# Altium schematic sheet CPU.SchDoc
size A4; Address1: PXL EAI 1001; Revision: V 1.0; SheetNumber: 2; SheetTotal: 5; Sheet: 2 van 5
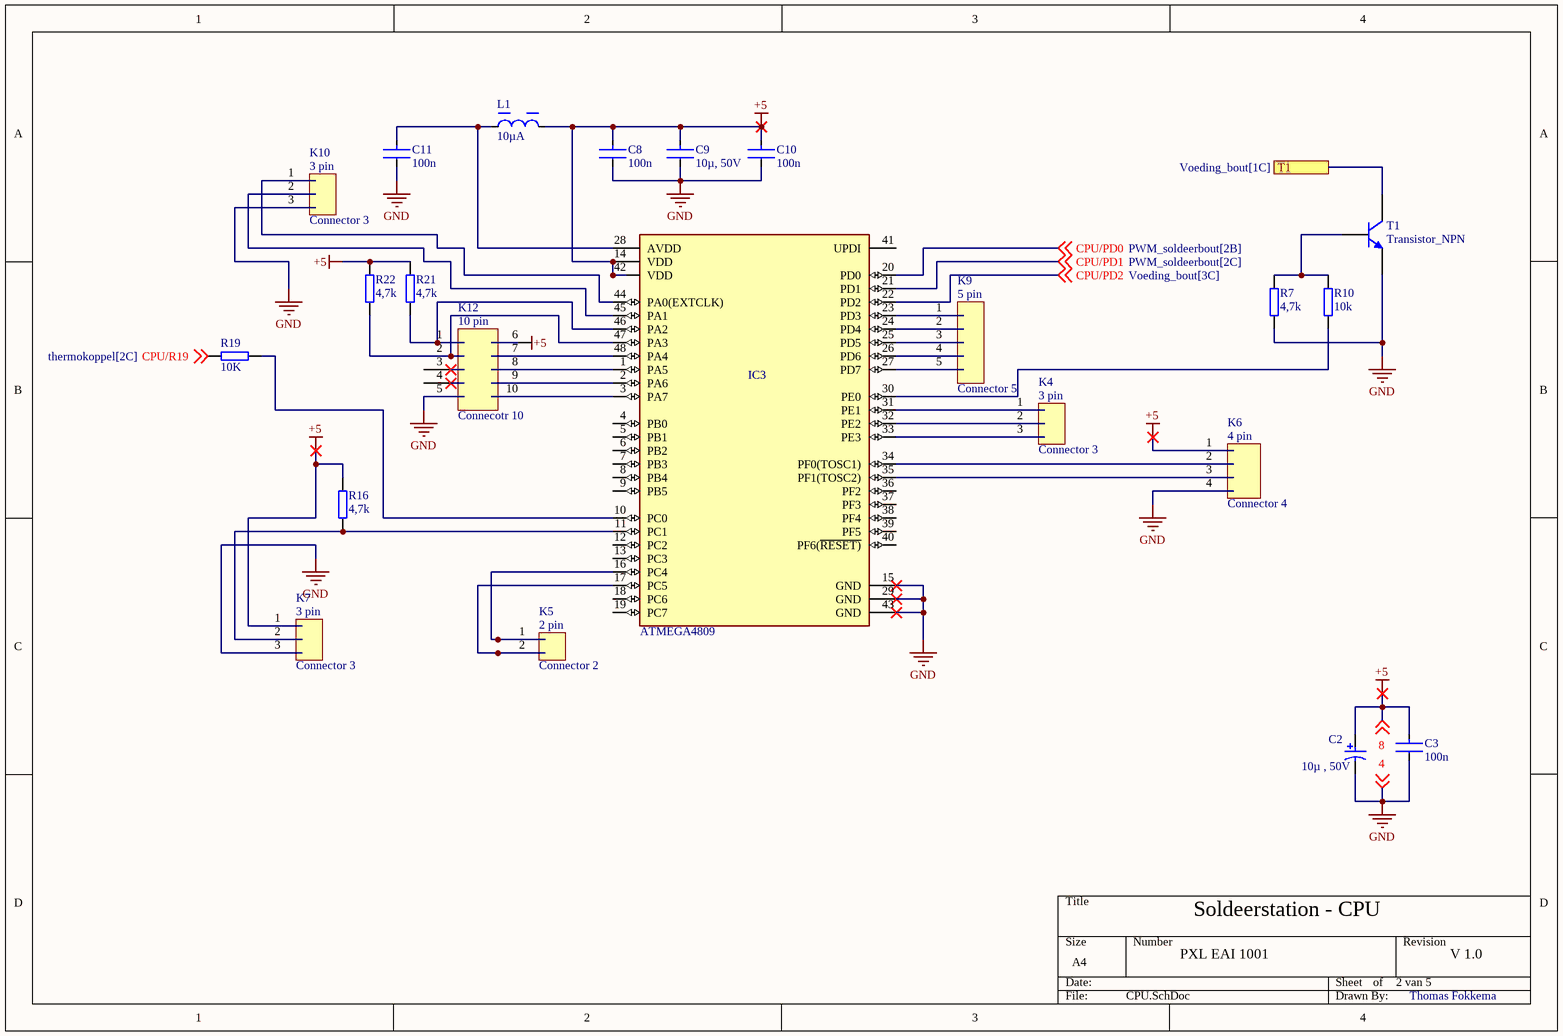
[diagram p0: CPU.SchDoc]

## Parts
C2  10µ , 50V  [CE_D8_L10]
C3  100n  [CC_0805_L]
C8  100n  [CC_0805_L]
C9  10µ, 50V  [CC_0805_L]
C10  100n  [CC_0805_L]
C11  100n  [CC_0805_L]
IC3  ATMEGA4809  [TQFP_48_M]
K4  Connector 3  [HDR1X3]
K5  Connector 2  [HDR1X2]
K6  Connector 4  [HDR1X4]
K7  Connector 3  [HDR1X3]
K9  Connector 5  [HDR1X5]
K10  Connector 3  [HDR1X3]
K12  Connecotr 10  [HDR2X5]
L1  10µA  [CC_0805_L]
R7  4,7k  [R_0805_M]
R10  10k  [R_0805_M]
R16  4,7k  [R_0805_M]
R19  10K  [R_0805_M]
R21  4,7k  [R_0805_M]
R22  4,7k  [R_0805_M]
T1  Transistor_NPN  [SOT_23]

## Ports
T1 (see Voeding_bout[1C])

## Nets
+5: C2.2 C3.1 C8.1 C9.1 C10.1 IC3.14(VDD) IC3.42(VDD) K6.1 K7.1 K12.6 L1.2 R16.2 R21.2 R22.2 ; off-sheet 8  [also labelled 8]
GND: C2.1 C3.2 C8.2 C9.2 C10.2 C11.2 IC3.15(GND) IC3.29(GND) IC3.43(GND) K6.4 K7.3 K10.3 K12.5 R7.1 T1.3(E) ; off-sheet 4  [also labelled 4]
CPU/PD0: IC3.20(PD0) ; off-sheet CPU/PD0
CPU/PD1: IC3.21(PD1) ; off-sheet CPU/PD1
CPU/PD2: IC3.22(PD2) ; off-sheet CPU/PD2
CPU/R19: R19.1 ; off-sheet CPU/R19
T1: T1.1(C) ; port T1
NetC11_1: C11.1 IC3.28(AVDD) L1.1
NetIC3_1: IC3.1(PA5) K12.8
NetIC3_2: IC3.2(PA6) K12.9
NetIC3_3: IC3.3(PA7) K12.10
NetIC3_10: IC3.10(PC0) R19.2
NetIC3_11: IC3.11(PC1) K7.2 R16.1
NetIC3_16: IC3.16(PC4) K5.1
NetIC3_17: IC3.17(PC5) K5.2
NetIC3_23: IC3.23(PD3) K9.1
NetIC3_24: IC3.24(PD4) K9.2
NetIC3_25: IC3.25(PD5) K9.3
NetIC3_26: IC3.26(PD6) K9.4
NetIC3_27: IC3.27(PD7) K9.5
NetIC3_30: IC3.30(PE0) R10.1
NetIC3_31: IC3.31(PE1) K4.1
NetIC3_32: IC3.32(PE2) K4.2
NetIC3_33: IC3.33(PE3) K4.3
NetIC3_34: IC3.34(PF0(TOSC1)) K6.2
NetIC3_35: IC3.35(PF1(TOSC2)) K6.3
NetIC3_44: IC3.44(PA0(EXTCLK)) K10.1
NetIC3_45: IC3.45(PA1) K10.2
NetIC3_46: IC3.46(PA2) K12.1 R21.1
NetIC3_47: IC3.47(PA3) K12.2 R22.1
NetIC3_48: IC3.48(PA4) K12.7
NetR7_2: R7.2 R10.2 T1.2(B)

Not connected (* = marked no-connect by the designer): IC3 4(PB0) 5(PB1) 6(PB2) 7(PB3) 8(PB4) 9(PB5) 12(PC2) 13(PC3) 18(PC6) 19(PC7) 36(PF2) 37(PF3) 38(PF4) 39(PF5) 40(PF6(~{RESET)}) 41(UPDI); K12 3(30)* 4(31)*

## Notes on the sheet
- Soldeerstation - CPU
- Thomas Fokkema
- (in symbol Connecotr 10) 10 pin
- (in symbol Connector 2) 2 pin
- (in symbol Connector 3) 3 pin
- (in symbol Connector 4) 4 pin
- (in symbol Connector 5) 5 pin

## Library data of the parts
C2 = Capacitor_Electrolytic: Manufacturer: Panasonic; Voltage Rating: 25 V; ComponentLink2URL: http://industrial.panasonic.com/cdbs/www-data/pdf/RDE0000/ABA0000C1181.pdf; Height: 10.2 mm; Max Operating Temperature: 105 degC; PackageReference: EEE-FK1E221P; ComponentLink1Description: Manufacturer URL; ComponentLink1URL: http://www.panasonic.com/; Mount: Surface Mount; REACH SVHC: No SVHC; Min Operating Temperature: -55 degC; ComponentLink2Description: Datasheet; DatasheetVersion: 03/2016; Length: 10.2 mm; RoHSCompliant: true; Packaging: Tape and Reel; Package Quantity: 500; Lead Pitch: 3.1 mm; Pins: 2; PackageDescription: 2-Pin Electrolytic Aluminum Capacitor, Body 8.3 x 8.3 mm; Mounting Technology: Surface Mount
C3 C8 C10 C11 = Capacitor_Ceramic: Manufacturer: KEMET; Manufacturer Part Number: C0805C224K5RACTU; Value: 0.22 μF; Temperature Characteristic: X7R; Temperature Coefficient: 30ppm/°C; Tolerance: 0.1; Voltage Rating: 50 V; ComponentLink2URL: https://content.kemet.com/datasheets/KEM_C1003_C0G_SMD.pdf; Device Class L3: Ceramic Capacitors; Lead Free: Yes; Temperature: -55°C to +125°C; RoHS: TRUE; Capacitance: 0.22 μF; Automotive: No; Material: Ceramic; Octopart: https://octopart.com/c0805c224k5ractu-kemet-144670; Temperature Range Low: -55°C; Height: 0.88mm; Device Class L1: Passive Components; Digikey Description: CAP CER 0.22UF 50V X7R 0805; ComponentLink2Description: Datasheet; Mouser Description: CAP CER 0.22UF 50V X7R 0805; Category: Cap; Ipc Land Pattern Name: CAPC200125X78; Temperature Range High: +125°C; Package: C0805C-DN; Device Class L2: Capacitors
C9 = Capacitor_Ceramic: Manufacturer: KEMET; Manufacturer Part Number: C0805C224K5RACTU; Value: 0.22 μF; Temperature Characteristic: X7R; Temperature Coefficient: 30ppm/°C; Tolerance: 0.1; ComponentLink2URL: https://content.kemet.com/datasheets/KEM_C1003_C0G_SMD.pdf; Device Class L3: Ceramic Capacitors; Lead Free: Yes; Temperature: -55°C to +125°C; RoHS: TRUE; Capacitance: 0.22 μF; Automotive: No; Material: Ceramic; Octopart: https://octopart.com/c0805c224k5ractu-kemet-144670; Temperature Range Low: -55°C; Height: 0.88mm; Device Class L1: Passive Components; Digikey Description: CAP CER 0.22UF 50V X7R 0805; ComponentLink2Description: Datasheet; Mouser Description: CAP CER 0.22UF 50V X7R 0805; Category: Cap; Ipc Land Pattern Name: CAPC200125X78; Temperature Range High: +125°C; Package: C0805C-DN; Device Class L2: Capacitors; Voltage Rating: 50 V
IC3 = ATMEGA4809: Peripherals: Brown-out Detect/Reset; Number of I/Os: 41; Core Architecture: AVR; Memory Size: 48KB; Interface: I2C; Oscillator Type: Internal; Memory Type: FLASH; Series: megaAVR® 0, Functional Safety (FuSa); Min Operating Temperature: -40°C; Mount: Surface Mount; Case/Package: TQFP; RoHS Compliant: Yes; Max Operating Temperature: 85°C
L1 = Choke: Tolerance: 20%; Shielding: Shielded; Saturation Current: 10A; Test Frequency: 100kHz; RMS Current (Irms): 8.5A; Inductance: 10uH; Series Resistance: 14.1R; DC Resistance (DCR): 14.1mR; Self Resonant Frequency: 18MHz; Ratings: AEC-Q200; Width: 12.8mm; Series: WE-HCI; Length: 0.512inch; Mount: Surface Mount; Resistor Type: Wirewound; RoHS Compliant: Yes; Package Quantity: 1; Min Operating Temperature: -40°C; Inductance Tolerance: 20%; Termination: SMD/SMT; Max DC Current: 8.5A; Height - Seated (Max): 0.197inch; Case/Package: 1350; Current Rating: 8.5A; Max Operating Temperature: 155°C; Packaging: Tape and Reel; Height: 4.7mm
R7 R10 R16 R19 R21 R22 = Resistor: Manufacturer: Vishay Dale; Part Number: CRCW08050000Z0EA
T1 = Transistor_NPN: Manufacturer: On Semiconductor; PartNumber: BC547C; IC Continuous (A): 0.1; fT Min (MHz): 150; Packing: Bulk Box; Polarity: NPN; Mounting Technology: Through Hole; ComponentLink1URL: http://www.onsemi.com/; ComponentLink1Description: Manufacturer URL; ComponentLink3URL: http://www.onsemi.cn/pub_link/Collateral/2N6426-D.PDF; DatasheetVersion: Rev. 7; PackageVersion: Rev. AM; RoHS: FALSE; ComponentLink2URL: http://www.onsemi.com/pub_link/Collateral/BC546-D.PDF; ComponentLink3Description: Package Specification; PackageDescription: 3-Pin Transistor Outline, Body 4.825 x 3.685 mm, Pitch 1.27 mm; PackageReference: TO-92-3-29-11_AM_SL; ComponentLink2Description: Datasheet